# EAGLE design Pi1541_Switch (EAGLE 9.2.2)
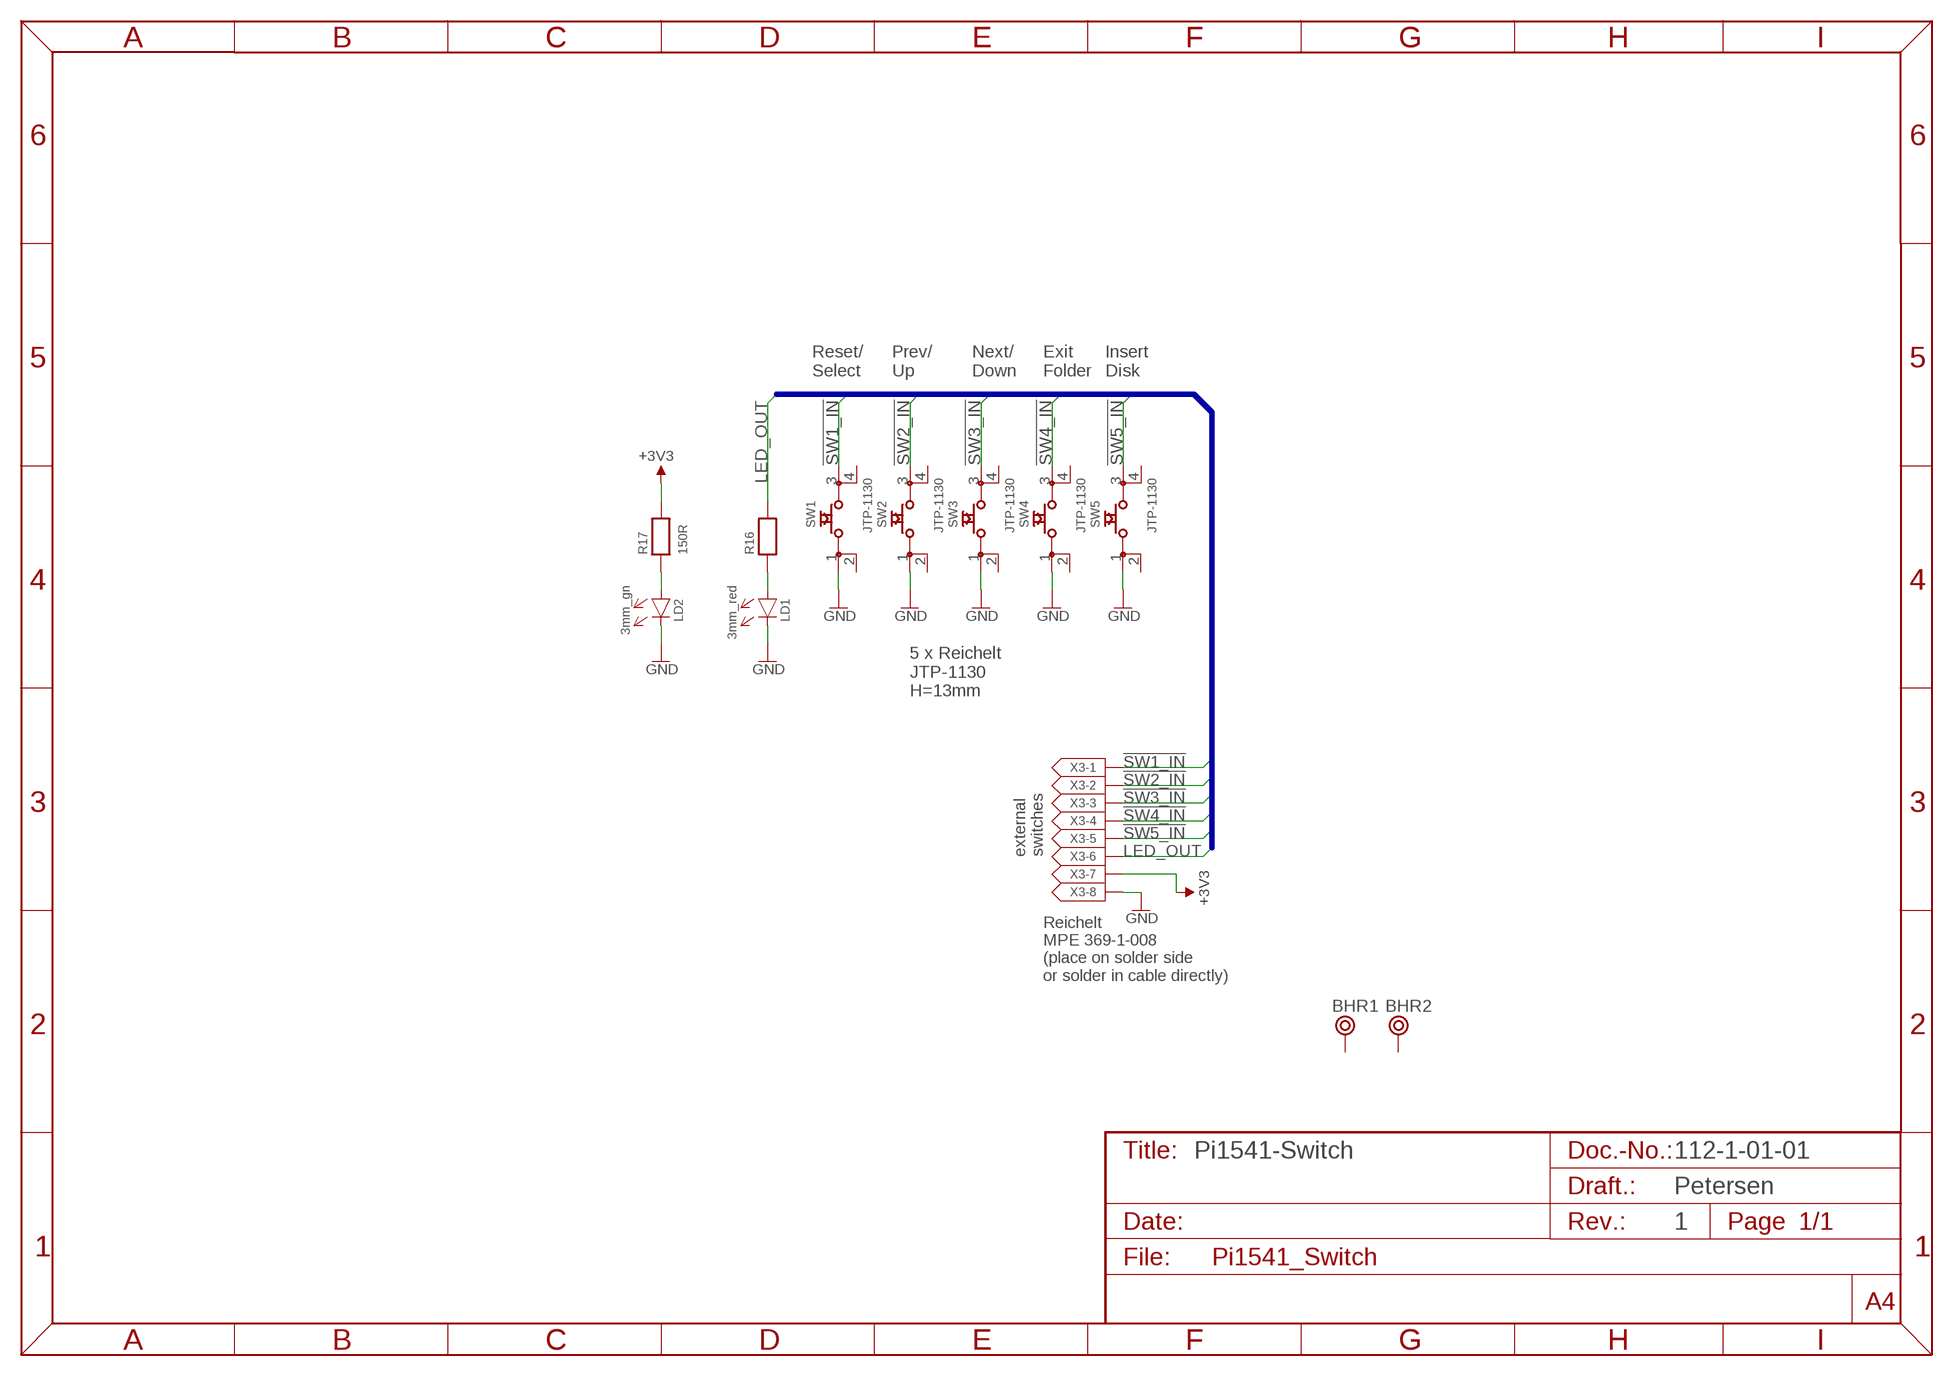
[diagram p0: schematic, sheet 1]

## Parts
BHR1  BOHR2,8  [BOHR2,8_]
BHR2  BOHR2,8  [BOHR2,8_]
LD1  3mm_red  3MM  [3MM]
LD2  3mm_gn  3MM  [3MM]
R16  150R  R-0805  [0805]
R17  150R  R-0805  [0805]
SW1  JTP-1130  [JTP-1130]
SW2  JTP-1130  [JTP-1130]
SW3  JTP-1130  [JTP-1130]
SW4  JTP-1130  [JTP-1130]
SW5  JTP-1130  [JTP-1130]
X3  MICMA08B  [MICMA08B]

## Nets
!SW1_IN: SW1.3 X3.1
!SW2_IN: SW2.3 X3.2
!SW3_IN: SW3.3 X3.3
!SW4_IN: SW4.3 X3.4
!SW5_IN: SW5.3 X3.5
+3V3: R17.2 X3.7
GND: LD1.K LD2.K SW1.1 SW2.1 SW3.1 SW4.1 SW5.1 X3.8
LED_OUT: R16.2 X3.6
N$7: LD2.A R17.1
N$12: LD1.A R16.1
Unconnected: BHR1.P$1 BHR2.P$1 SW1.2 SW1.4 SW2.2 SW2.4 SW3.2 SW3.4 SW4.2 SW4.4 SW5.2 SW5.4

## Buses
RASPI_SIG:ATN_IN,CE0,CE1,CLK_IN,!CLK_OUT,DATA_IN,!DATA_OUT,ID_SC,ID_SD,LED_OUT,MISO,MOSI,!RESET_IN,SCL,SCLK,SDA,SND_OUT,!SQR_OUT,!SW1_IN,!SW2_IN,!SW3_IN,!SW4_IN,!SW5_IN

## Notes on the sheet
- Reset/
  Select
- Prev/
  Up
- Next/
  Down
- Exit
  Folder
- Insert
  Disk
- 5 x Reichelt
  JTP-1130
  H=13mm
- external
  switches
- Reichelt
  MPE 369-1-008
  (place on solder side
  or solder in cable directly)
- Pi1541-Switch | 112-1-01-01
- Petersen
- 1

## Library data of the parts
BHR1 BHR2 = Mech_Bohr:BOHR2,8
LD1 LD2 = LED:3MM
R16 R17 = SMD:R-0805
SW1-SW5 = Namae_Electronics:JTP-1130
X3 = AMP:MICMA08B

## Board
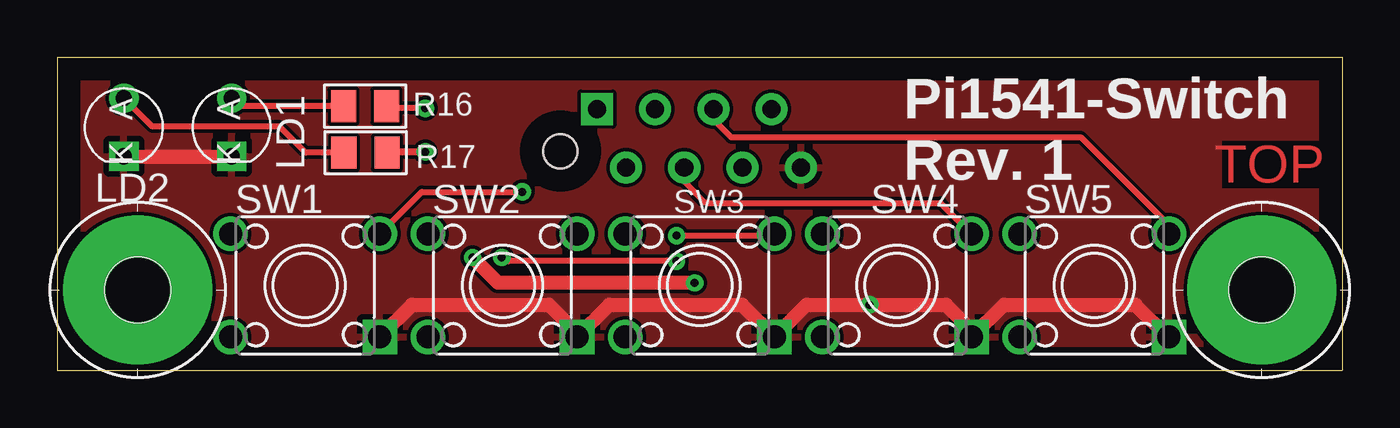
[diagram p1: board, top side]
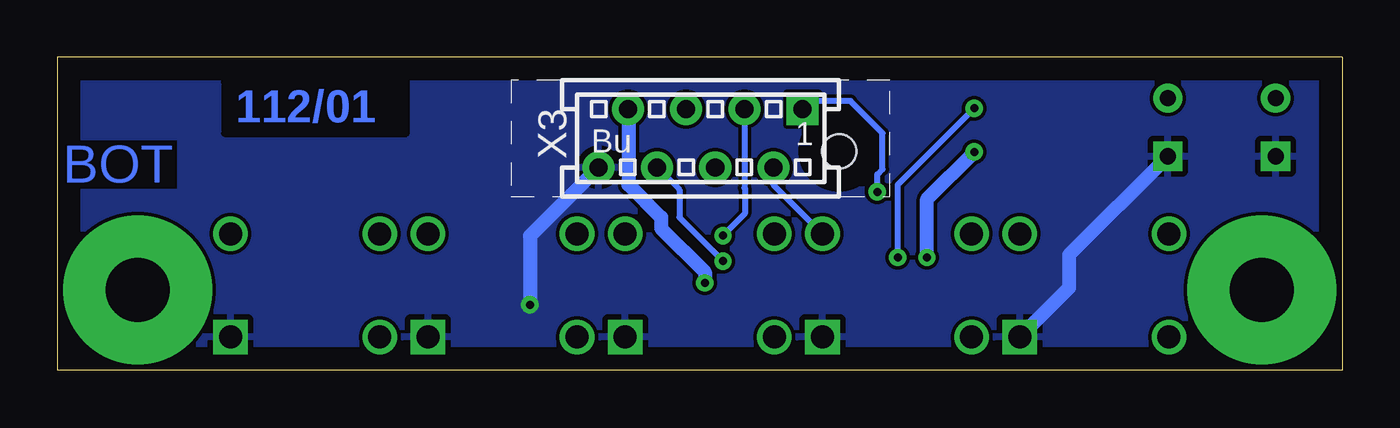
[diagram p2: board, bottom side, seen from below]

Size 56 x 13.65 mm. Coordinates in mm from the lower left corner, seen from the top.
Outline: 0,0 56,0 56,13.65 0,13.65 0,0
Copper layers (1*16): Top 0.035mm / dielectric 1.5mm / Bottom 0.035mm
Design rules "default *": minimum track width 6mil, minimum drill 0.35mm, track to track 6mil, track to pad 6mil, pad to pad 6mil, via to via 6mil, smd to smd 6mil, copper to edge 40mil, drill to drill 6mil, minimum pad ring 10mil, minimum via ring 8mil, stop-mask expansion 4mil, vias tented up to drill 0.5mm, thermal gap 10mil
bRestrict: 3 lines

### Footprints (pad centres in the part's own frame; a part is rotated, then mirrored left to right if it is on the bottom)
BOHR2,8_ = drill 2.794 pad 6.502: P$1 0,0
3MM = drill 0.7 pad 1.27: A -1.27,0 | drill 0.7 pad 1.27 square: K 1.27,0
0805 = smd 1.092 x 1.397: 1 -0.94,0; 2 0.94,0
JTP-1130 = drill 1 square: 1 3.25,-2.25 | drill 1: 2 -3.25,-2.25; 3 3.25,2.25; 4 -3.25,2.25
MICMA08B = drill 0.787 pad 1.397 square: 1 4.445,1.27 | drill 0.787 pad 1.397: 2 3.175,-1.27; 3 1.905,1.27; 4 0.635,-1.27; 5 -0.635,1.27; 6 -1.905,-1.27; 7 -3.175,1.27; 8 -4.445,-1.27 | hole 1.5: 6.032,-0.568

### Placement (x,y rotation side)
BHR1  3.5,3.5 0 top
BHR2  52.5,3.5 0 top
LD1  7.6,10.6 270 top
LD2  2.9,10.6 270 top
R16  13.41,11.52 0 top
R17  13.43,9.49 0 top
SW1  10.8,3.7 0 top
SW2  19.4,3.7 0 top
SW3  28,3.7 0 top
SW4  36.6,3.7 0 top
SW5  45.2,3.7 0 top
U$44  [2LAYER]  55.24,9.84 180 top
U$45  [PCB-TITLE/]  0.16,27.93 0 top  (outside the outline)
X3  27.96,10.12 0 bottom

### Tracks (layer width: path | path; a pad name or v marks a point on that pad's centre or on a via)
!SW1_IN  (via drill 0.35)
  Top 0.254: SW1.3 15.88,7.78 v20.26,7.78
  Bottom 0.254: v20.26,7.78 20.26,8.54 20.04,8.77 20.04,10.34 21.43,11.73 21.43,11.75 23.16,11.75 X3.1
!SW2_IN
  Bottom 0.254: SW2.3 24.79,8.09 X3.2
!SW3_IN  (via drill 0.35)
  Top 0.254: v26.99,5.87 31.17,5.87 SW3.3
  Bottom 0.254: X3.3 26.05,7.96 26.04,7.94 26.04,6.83 v26.99,5.87
!SW4_IN
  Top 0.254: X3.4 27.32,8.23 28.26,7.3 38.5,7.3 SW4.3
!SW5_IN
  Top 0.254: SW5.3 48.42,5.95 48.42,6.35 44.61,10.16 29.37,10.16 28.59,10.93 X3.5
+3V3  (via drill 0.35)
  Top 0.305: v16.03,9.53 14.4,9.53 R17.2
  Top 0.61: v27.78,3.81 19.21,3.81 v18.1,4.92
  Bottom 0.61: v18.1,4.92 18.1,7.46 v16.03,9.53 | X3.7 31.11,11.37 31.11,8.1 29.69,6.67 29.69,6.19 27.78,4.29 v27.78,3.81
GND  (via drill 0.35)
  Top 0.61: LD2.K LD1.K | SW1.1 15.46,2.86 21.43,2.86 22.65,1.64 SW2.1 24.06,2.86 29.84,2.86 SW3.1 32.66,2.86 v35.4,2.86 38.73,2.86 39.85,1.74 SW4.1 41.26,2.86 46.99,2.86 48.4,1.45 SW5.1
  Bottom 0.61: LD1.K 11.91,5.02 11.91,3.59 SW1.1 | X3.8 35.4,5.85 v35.4,2.86
  pour Top: 0.48,13.29 0.48,0.48 55.56,0.48 55.56,13.29
  pour Bottom: 0.48,13.29 55.56,13.29 55.56,0.48 0.48,0.48
LED_OUT  (via drill 0.35)
  Top 0.254: v26.99,4.76 19.68,4.76 19.37,5.08 v19.37,4.92 | v16.03,11.43 14.44,11.43 R16.2
  Bottom 0.254: v19.37,4.92 19.37,8.1 v16.03,11.43 | X3.6 28.89,7.88 28.89,6.67 v26.99,4.76
N$7
  Top 0.254: R17.1 10.83,9.49 9.68,10.64 4.13,10.64 LD2.A
N$12
  Top 0.254: R16.1 7.95,11.52 LD1.A

### Text on the board
Bottom: 112/01
tPlace: Pi1541-Switch / Rev. 1
Document: 112-2-01-01 | Sven Petersen / 2019 | 35µm | 2 | 1